# EAGLE design nightlight (EAGLE 7.7.0)
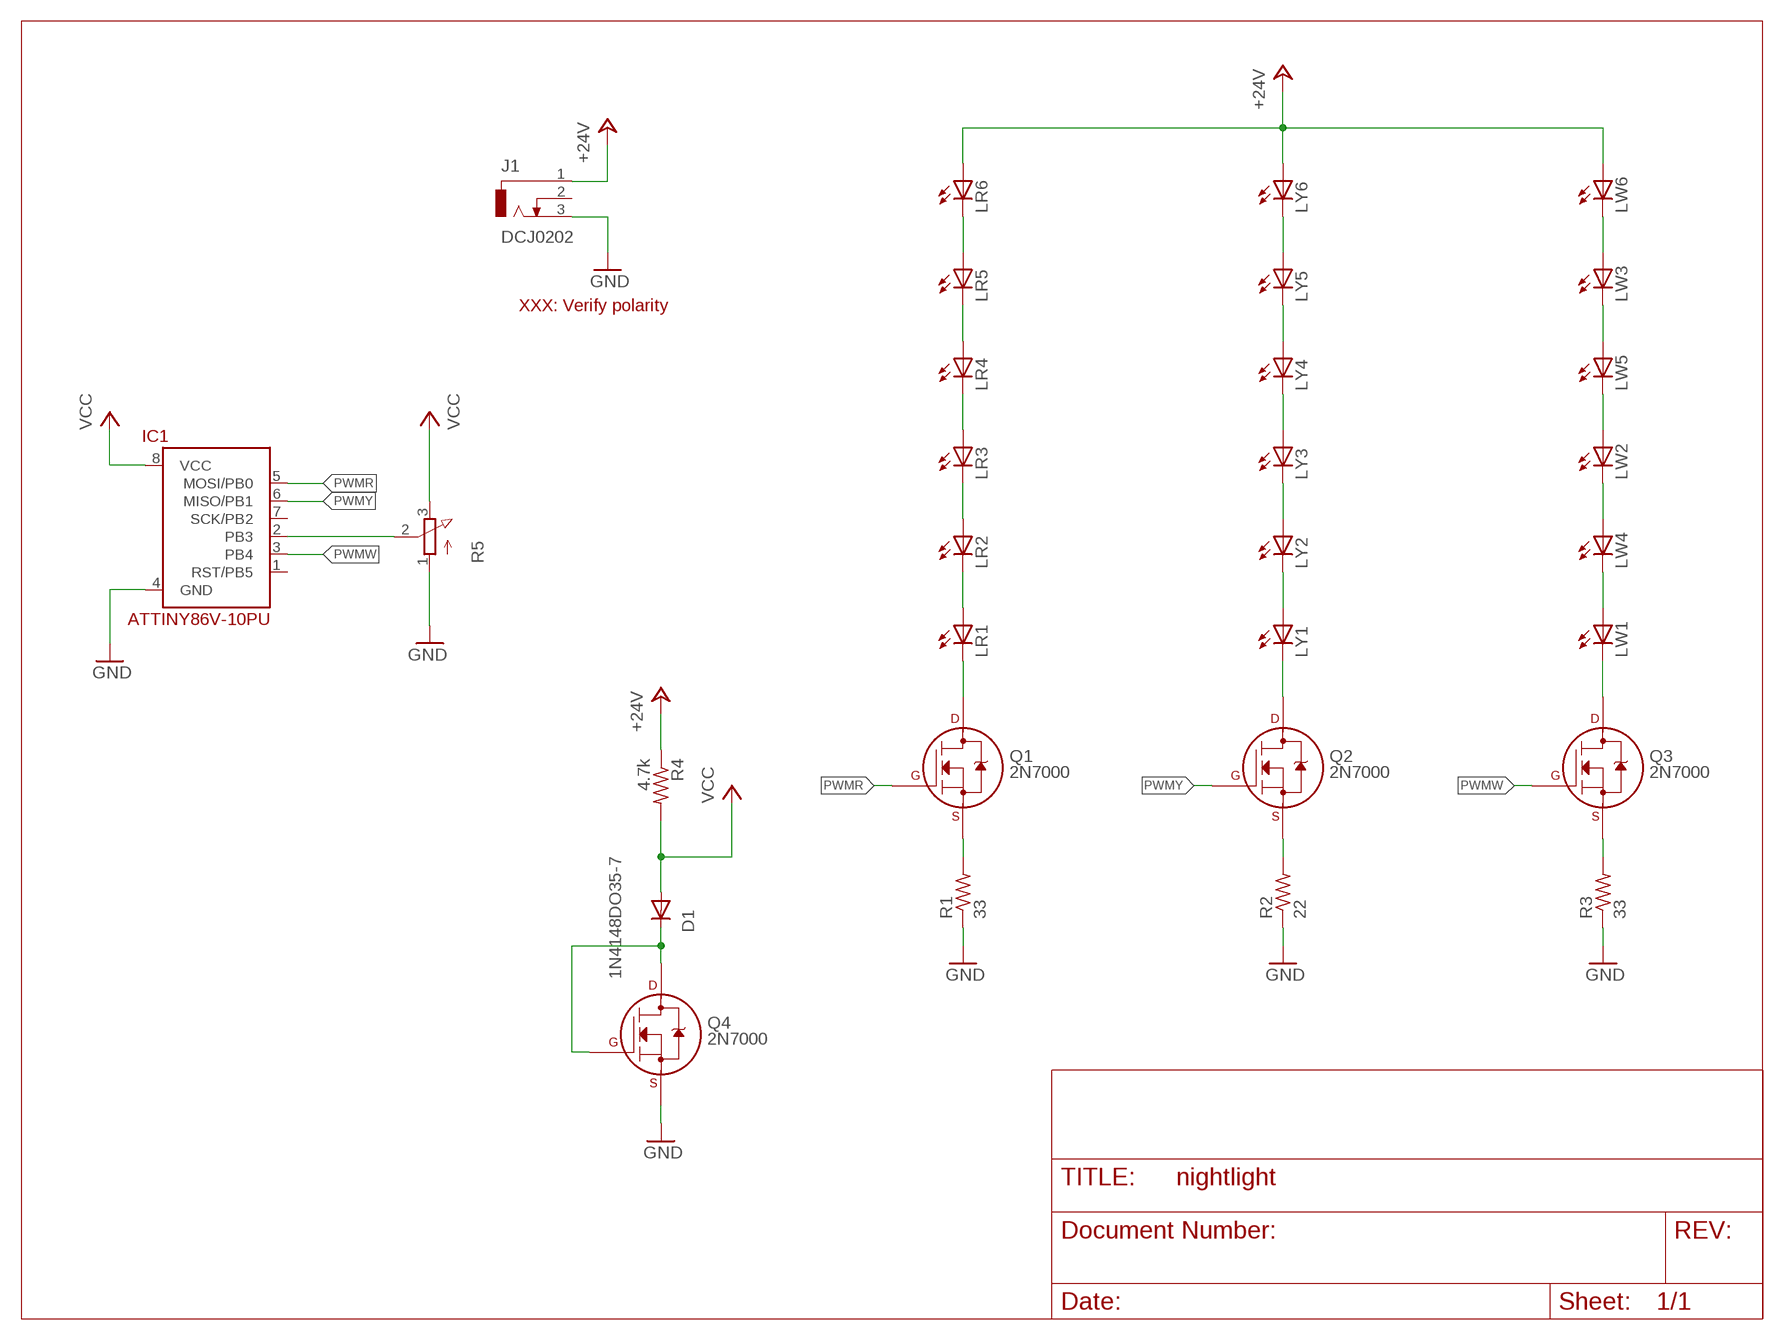
[diagram p0: schematic, sheet 1]

## Parts
D1  1N4148DO35-7  [DO35-7]
IC1  ATTINY86V-10PU  ATTINY13V-10PU  [DIL08]
J1  DCJ0202  [DCJ0202]
LR1  LED5MM  [LED5MM]
LR2  LED5MM  [LED5MM]
LR3  LED5MM  [LED5MM]
LR4  LED5MM  [LED5MM]
LR5  LED5MM  [LED5MM]
LR6  LED5MM  [LED5MM]
LW1  LED5MM  [LED5MM]
LW2  LED5MM  [LED5MM]
LW3  LED5MM  [LED5MM]
LW4  LED3MM  [LED3MM]
LW5  LED3MM  [LED3MM]
LW6  LED3MM  [LED3MM]
LY1  LED5MM  [LED5MM]
LY2  LED5MM  [LED5MM]
LY3  LED5MM  [LED5MM]
LY4  LED5MM  [LED5MM]
LY5  LED5MM  [LED5MM]
LY6  LED5MM  [LED5MM]
Q1  2N7000  2N7000_TO92  [TO-92]
Q2  2N7000  2N7000_TO92  [TO-92]
Q3  2N7000  2N7000_TO92  [TO-92]
Q4  2N7000  2N7000_TO92  [TO-92]
R1  33  R-US_0207/10  [0207/10]
R2  22  R-US_0207/10  [0207/10]
R3  33  R-US_0207/10  [0207/10]
R4  4.7k  R-US_0207/10  [0207/10]
R5  3RP/1610N  [3RP/1610N]

## Nets
+24V: J1.1 LR6.A LW6.A LY6.A R4.1
GND: IC1.4(GND) J1.3 Q4.1(S) R1.1 R2.1 R3.1 R5.1(A)
N$1: LR1.K(C) Q1.3(D)
N$2: LR1.A LR2.K(C)
N$3: LR2.A LR3.K(C)
N$4: LR3.A LR4.K(C)
N$5: LR4.A LR5.K(C)
N$6: LR5.A LR6.K(C)
N$7: LY5.A LY6.K(C)
N$8: LY4.A LY5.K(C)
N$9: LY3.A LY4.K(C)
N$10: LY2.A LY3.K(C)
N$11: LY1.A LY2.K(C)
N$12: LY1.K(C) Q2.3(D)
N$13: LW1.K(C) Q3.3(D)
N$14: LW1.A LW4.K(C)
N$15: LW2.K(C) LW4.A
N$16: LW2.A LW5.K(C)
N$17: LW3.K(C) LW5.A
N$18: Q1.1(S) R1.2
N$19: Q2.1(S) R2.2
N$20: Q3.1(S) R3.2
N$21: LW3.A LW6.K(C)
N$22: D1.C Q4.2(G) Q4.3(D)
N$23: IC1.2(PB3) R5.2(S)
PWMR: IC1.5(MOSI/PB0) Q1.2(G)
PWMW: IC1.3(PB4) Q3.2(G)
PWMY: IC1.6(MISO/PB1) Q2.2(G)
VCC: D1.A IC1.8(VCC) R4.2 R5.3(E)
Unconnected: IC1.1(RST/PB5) IC1.7(SCK/PB2) J1.2

## Notes on the sheet
- XXX: Verify polarity

## Library data of the parts
D1 = diode:1N4148: DIODE high speed (Philips)
IC1 = attiny13:ATTINY13V-10*
J1 = con-jack:DCJ0202: DC POWER JACK Source: DCJ0202.pdf; OC_FARNELL: unknown; OC_NEWARK: unknown
LR1-LR6 LW1-LW3 LY1-LY6 = led:LED: LED OSRAM: - CHIPLED LG R971, LG N971, LY N971, LG Q971, LY Q971, LO R971, LY R971 LH N974, LH R974 LS Q976, LO Q976, LY Q976 LO Q996 - Hyper CHIPLED LW Q18S LB Q993, LB Q99A, LB R99A - SideLED LS A670, LO A670, LY A670, LG A670, LP A670 LB A673, LV A673, LT A673, LW A673 LH A674 LY A675 LS A676, LA A676, LO A676, LY A676, LW A676 LS A679, LY A679, LG A679 - Hyper Micro SIDELED® LS Y876, LA Y876, LO Y876, LY Y876 LT Y87S - SmartLED LW L88C, LW L88S LB L89C, LB L89S, LG L890 LS L89K, LO L89K, LY L89K LS L896, LA L896, LO L896, LY L896 - TOPLED LS T670, LO T670, LY T670, LG T670, LP T670 LSG T670, LSP T670, LSY T670, LOP T670, LYG T670 LG T671, LOG T671, LSG T671 LB T673, LV T673, LT T673, LW T673 LH T674 LS T676, LA T676, LO T676, LY T676, LB T676, LH T676, LSB T676, LW T676 LB T67C, LV T67C, LT T67C, LS T67K, LO T67K, LY T67K, LW E67C LS E67B, LA E67B, LO E67B, LY E67B, LB E67C, LV E67C, LT E67C LW T67C LS T679, LY T679, LG T679 LS T770, LO T770, LY T770, LG T770, LP T770 LB T773, LV T773, LT T773, LW T773 LH T774 LS E675, LA E675, LY E675, LS T675 LS T776, LA T776, LO T776, LY T776, LB T776 LHGB T686 LT T68C, LB T68C - Hyper Mini TOPLED® LB M676 - Mini TOPLED Santana® LG M470 LS M47K, LO M47K, LY M47K Source: http://www.osram.convergy.de LUXEON: - LUMILED® LXK2-PW12-R00, LXK2-PW12-S00, LXK2-PW14-U00, LXK2-PW14-V00 LXK2-PM12-R00, LXK2-PM12-S00, LXK2-PM14-U00 LXK2-PE12-Q00, LXK2-PE12-R00, LXK2-PE12-S00, LXK2-PE14-T00, LXK2-PE14-U00 LXK2-PB12-K00, LXK2-PB12-L00, LXK2-PB12-M00, LXK2-PB14-N00, LXK2-PB14-P00, LXK2-PB14-Q00 LXK2-PR12-L00, LXK2-PR12-M00, LXK2-PR14-Q00, LXK2-PR14-R00 LXK2-PD12-Q00, LXK2-PD12-R00, LXK2-PD12-S00 LXK2-PH12-R00, LXK2-PH12-S00 LXK2-PL12-P00, LXK2-PL12-Q00, LXK2-PL12-R00 Source: www.luxeon.com KINGBRIGHT: KA-3528ASYC Source: www.kingbright.com
LW4-LW6 = SparkFun:LED: LEDs Standard schematic elements and footprints for 5mm, 3mm, 1206, and 0603 sized LEDs. 5mm - Spark Fun Electronics SKU : COM-00529 (and others)
Q1-Q4 = transistors:2N700*: 2N7000, 2N7002, NDS7002A N-channel enhancement mode MOSFET
R1-R4 = rcl:R-US_: RESISTOR, American symbol
R5 = pot:3RP/1610N: 16mm Potentiometer one level Source: http://www.alphapotentiometers.net/html/16mm_pot_2.html

## Net classes
0 default: width 1.016 mm

## Board
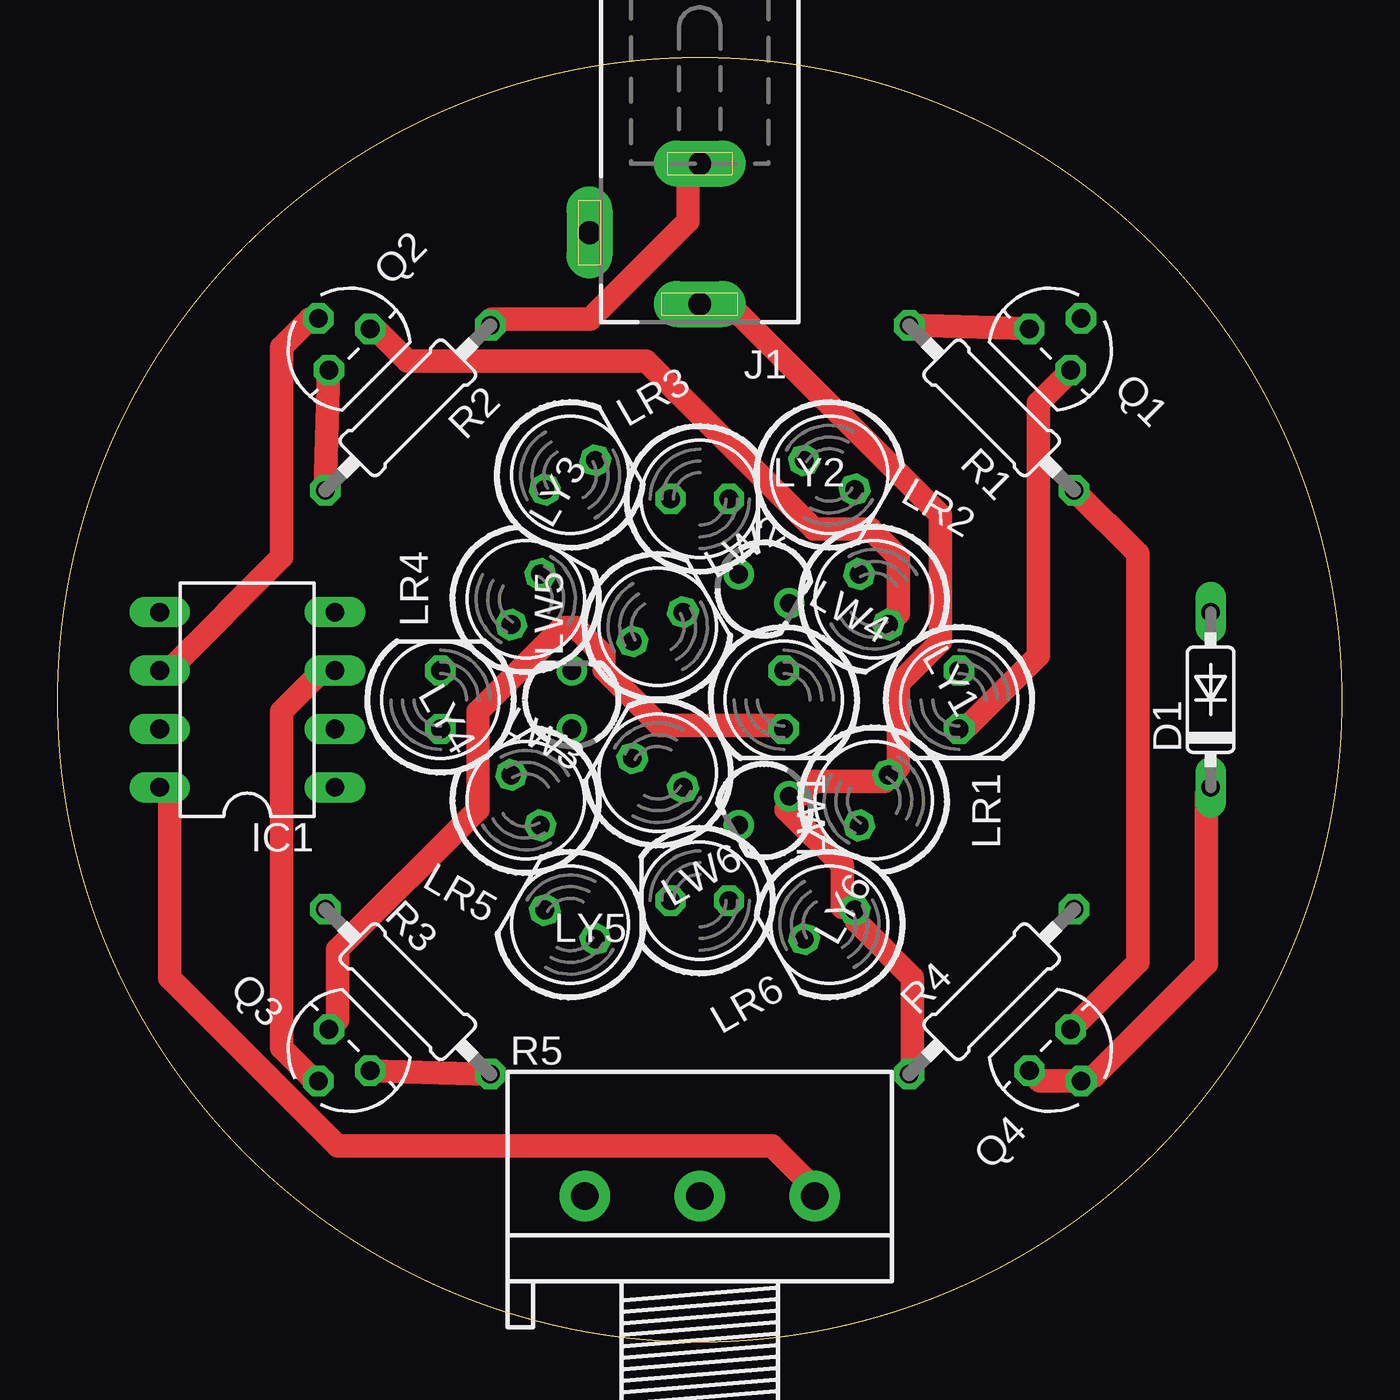
[diagram p1: board, top side]
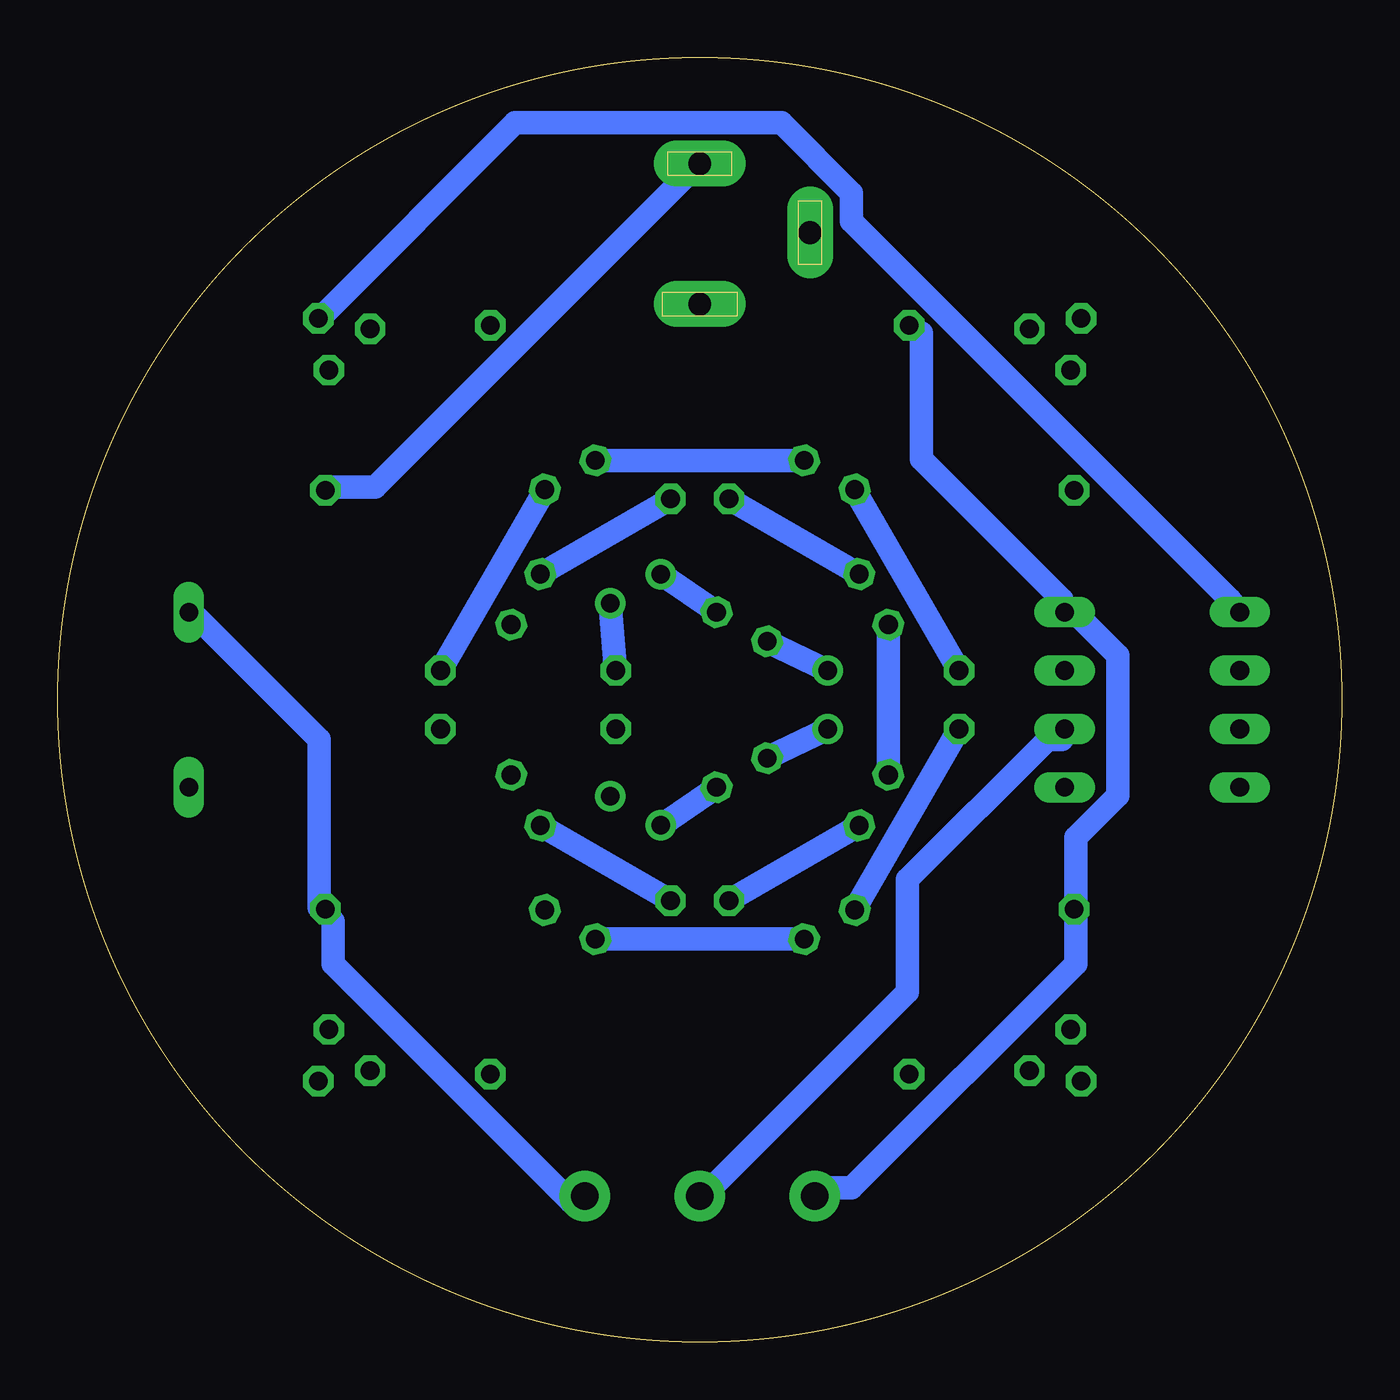
[diagram p2: board, bottom side, seen from below]

Size 55.88 x 55.88 mm. Coordinates in mm from the lower left corner, seen from the top.
Outline: circle at 27.94,27.94 radius 27.94
Copper layers (1*16): Top 0.035mm / dielectric 1.5mm / Bottom 0.035mm
Design rules "default": minimum track width 10mil, minimum drill 24mil, track to track 8mil, track to pad 8mil, pad to pad 8mil, via to via 8mil, smd to smd 8mil, copper to edge 40mil, drill to drill 8mil, minimum pad ring 10mil, minimum via ring 8mil, stop-mask expansion 4mil, vias tented up to drill 0mil, thermal gap 10mil

### Footprints (pad centres in the part's own frame; a part is rotated, then mirrored left to right if it is on the bottom)
DO35-7 = drill 0.813 long: A 3.81,0; C -3.81,0
DIL08 = drill 0.813 long: 1 -3.81,-3.81; 2 -1.27,-3.81; 3 1.27,-3.81; 4 3.81,-3.81; 5 3.81,3.81; 6 1.27,3.81; 7 -1.27,3.81; 8 -3.81,3.81
DCJ0202 = drill 1 pad 2 long: 1 0,3.1; 2 4.8,0; 3 0,-3
LED5MM = drill 0.813 octagon: A -1.27,0; K 1.27,0
LED3MM = drill 0.813: A -1.27,0; K 1.27,0
TO-92 = drill 0.813 octagon: 1 -1.27,0; 2 0,1.905; 3 1.27,0
0207/10 = drill 0.813 octagon: 1 -5.08,0; 2 5.08,0
3RP/1610N = drill 1.2 pad 2.184: 1 -5,0; 2 0,0; 3 5,0

### Placement (x,y rotation side)
D1  50.16,27.94 90 top
IC1  8.26,27.94 90 top
J1  27.94,48.26 180 top
LR1  39.22,27.94 270 top
LR2  33.58,37.72 330 top
LR3  22.3,37.72 30 top
LR4  16.66,27.94 90 top
LR5  22.3,18.16 150 top
LR6  33.58,18.16 210 top
LW1  31.6,27.94 270 top
LW2  26.11,31.11 30 top
LW3  26.11,24.77 150 top
LW4  30.73,32.77 330 top
LW5  22.38,27.94 90 top
LW6  30.73,23.11 210 top
LY1  35.51,32.31 300 top
LY2  27.94,36.68 0 top
LY3  20.37,32.31 60 top
LY4  20.37,23.57 120 top
LY5  27.94,19.2 180 top
LY6  35.51,23.57 240 top
Q1  43.18,43.18 315 top
Q2  12.7,43.18 45 top
Q3  12.7,12.7 135 top
Q4  43.18,12.7 225 top
R1  40.64,40.64 135 top
R2  15.24,40.64 225 top
R3  15.24,15.24 315 top
R4  40.64,15.24 45 top
R5  27.94,6.35 0 top

### Tracks (layer width: path | path; a pad name or v marks a point on that pad's centre or on a via)
+24V
  Top 1.016: R4.1 37.19,12.19 37.19,15.85 34.75,18.29 LR6.A 34.14,18.9 34.14,20.73 31.7,23.16 LW6.A 32.31,23.77 32.92,24.38 35.97,24.38 LY6.A 36.58,24.99 36.58,28.65 38.41,30.48 38.41,35.97 29.26,45.11 28.04,45.11 J1.1
GND
  Top 1.016: R2.1 18.9,44.5 23.16,44.5 27.43,48.77 27.43,51.21 J1.3 | Q4.1 46.99,16.51 46.99,34.29 R1.1
  Bottom 1.016: R5.1 22.55,6.71 21.34,6.71 11.58,16.46 11.58,18.29 R3.1 11.58,18.9 11.58,21.95 9.75,23.77 9.75,29.87 11.58,31.7 IC1.4 12.19,32.31 18.29,38.41 18.29,43.89 R2.1 | R1.1 43.89,37.19 42.06,37.19 28.04,51.21 J1.3
N$1
  Top 1.016: LR1.K 39.62,26.82 42.67,29.87 42.67,40.84 43.89,42.06 Q1.3
N$2
  Bottom 1.016: LR1.A LR2.K
N$3
  Bottom 1.016: LR2.A LR3.K
N$4
  Bottom 1.016: LR3.A LR4.K
N$5
  Bottom 1.016: LR4.A LR5.K
N$6
  Bottom 1.016: LR5.A LR6.K
N$7
  Bottom 1.016: LY5.A LY6.K
N$8
  Bottom 1.016: LY4.A LY5.K
N$9
  Bottom 1.016: LY3.A LY4.K
N$10
  Bottom 1.016: LY2.A LY3.K
N$11
  Bottom 1.016: LY1.A LY2.K
N$12
  Top 1.016: LY1.K 36.58,31.7 36.58,34.14 35.36,35.36 32.92,35.36 25.6,42.67 15.24,42.67 14.02,43.89 Q2.3
N$13
  Top 1.016: Q3.3 12.19,14.02 12.19,17.07 18.29,23.16 18.29,27.43 21.95,31.09 22.55,31.09 23.77,29.87 23.77,29.26 26.21,26.82 31.09,26.82 LW1.K
N$14
  Bottom 1.016: LW4.K LW1.A
N$15
  Bottom 1.016: LW4.A LW2.K
N$16
  Bottom 1.016: LW2.A LW5.K
N$17
  Bottom 1.016: LW5.A LW3.K
N$18
  Top 1.016: Q1.1 R1.2
N$19
  Top 1.016: Q2.1 R2.2
N$20
  Top 1.016: Q3.1 R3.2
N$21
  Bottom 1.016: LW3.A LW6.K
N$22
  Top 1.016: D1.C 49.99,23.77 49.99,16.46 45.11,11.58 Q4.2 42.73,11.35 Q4.3
N$23
  Bottom 1.016: IC1.2 12.19,26.21 12.8,26.21 18.9,20.12 18.9,15.24 27.43,6.71 R5.2
PWMR
  Bottom 1.016: IC1.5 4.88,32.31 21.34,48.77 21.34,49.99 24.38,53.03 35.97,53.03 44.5,44.5 Q1.2
PWMW
  Top 1.016: Q3.2 10.97,11.58 9.75,12.8 9.75,27.43 11.58,29.26 IC1.3
PWMY
  Top 1.016: IC1.6 4.88,29.26 9.75,34.14 9.75,43.28 10.97,44.5 Q2.2
VCC
  Top 1.016: IC1.8 4.88,23.77 4.88,15.85 12.19,8.53 31.09,8.53 32.92,6.71 R5.3
  Bottom 1.016: D1.A 49.99,31.7 44.5,26.21 44.5,18.9 R4.2 43.89,18.29 43.89,16.46 33.53,6.1 R5.3

### Text on the board
tDocu: W131571ASN11